# EAGLE schematic FLODAR_V3 (EAGLE 9.6.2)
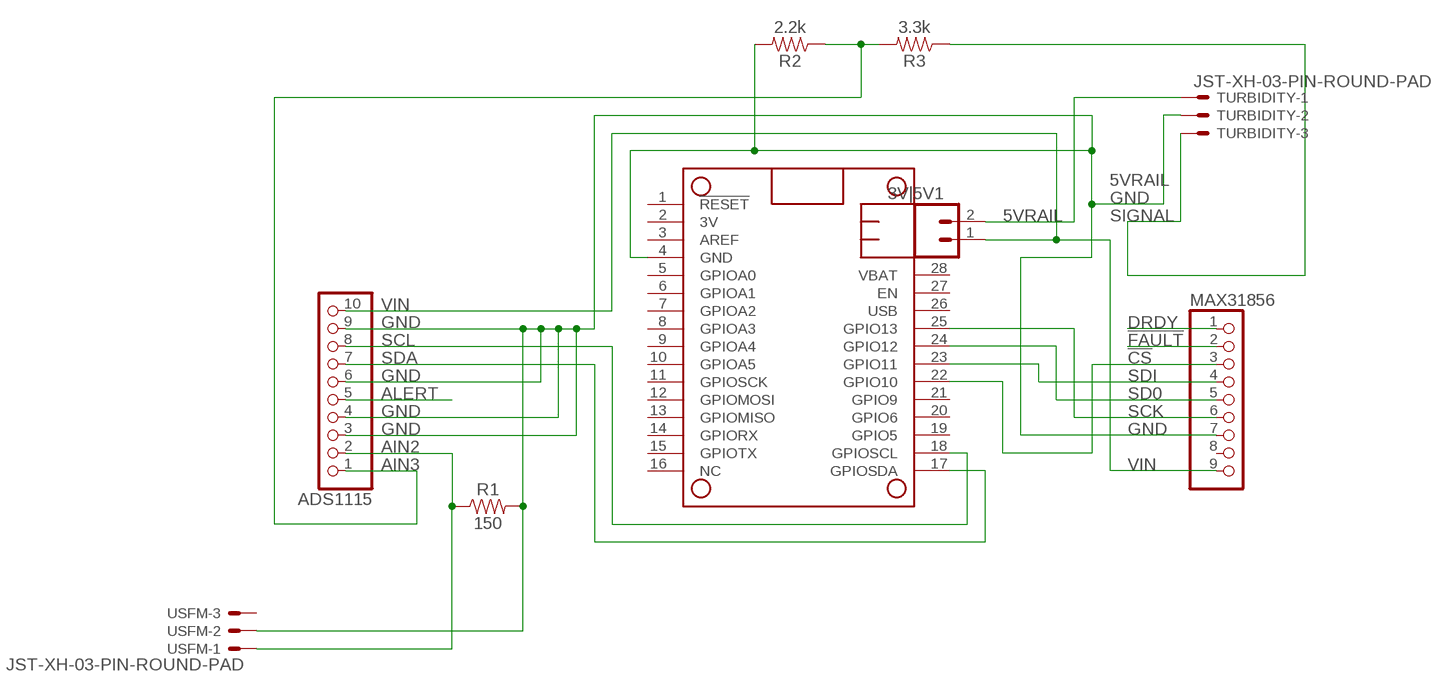
[diagram p0: schematic, sheet 1]

## Parts
3V|5V1  CONN_021X02_NO_SILK  [1X02_NO_SILK]
ADS1115  HEADER-1X1070MIL  [1X10_ROUND70]
MAX31856  HEADER-1X970MIL  [1X09_ROUND_70]
MS3  FEATHERWING  [FEATHERWING]
R1  150  150OHM-0603-1/10W-1%  [0603]
R2  2.2k  2.2KOHM-0603-1/10W-1%  [0603]
R3  3.3k  3.3KOHM-0603-1/10W-1%  [0603]
TURBIDITY  JST-XH-03-PIN-ROUND-PAD  [JST-XH-03-PACKAGE-ROUND-PAD]
USFM  JST-XH-03-PIN-ROUND-PAD  [JST-XH-03-PACKAGE-ROUND-PAD]

## Nets
5VRAIL: 3V|5V1.2 TURBIDITY.1
!CS: MAX31856.3 MS3.22(GPIO10)
!FAULT: MAX31856.2
AIN2: ADS1115.2 R1.1 USFM.1
AIN3: ADS1115.1 R2.1 R3.2
ALERT: ADS1115.5
DRDY: MAX31856.1
GND: ADS1115.3 ADS1115.4 ADS1115.6 ADS1115.9 MAX31856.7 MS3.4(GND) R1.2 R2.2 TURBIDITY.2 USFM.2
SCK: MAX31856.6 MS3.25(GPIO13)
SCL: ADS1115.8 MS3.18(GPIOSCL)
SD0: MAX31856.5 MS3.24(GPIO12)
SDA: ADS1115.7 MS3.17(GPIOSDA)
SDI: MAX31856.4 MS3.23(GPIO11)
SIGNAL: R3.1 TURBIDITY.3
VIN: 3V|5V1.1 ADS1115.10 MAX31856.9
Unconnected: MAX31856.8 MS3.1(!RESET) MS3.2(3V) MS3.3(AREF) MS3.5(GPIOA0) MS3.6(GPIOA1) MS3.7(GPIOA2) MS3.8(GPIOA3) MS3.9(GPIOA4) MS3.10(GPIOA5) MS3.11(GPIOSCK) MS3.12(GPIOMOSI) MS3.13(GPIOMISO) MS3.14(GPIORX) MS3.15(GPIOTX) MS3.16(NC) MS3.19(GPIO5) MS3.20(GPIO6) MS3.21(GPIO9) MS3.26(USB) MS3.27(EN) MS3.28(VBAT) USFM.3

## Library data of the parts
3V|5V1 = SparkFun-Connectors:CONN_02: Multi connection point. Often used as Generic Header-pin footprint for 0.1 inch spaced/style header connections On any of the 0.1 inch spaced packages, you can populate with these: Break Away Headers - Straight <https://www.sparkfun.com/products/116> (PRT-00116) Break Away Male Headers - Right Angle <https://www.sparkfun.com/products/553> (PRT-00553) Female Headers <https://www.sparkfun.com/products/115> (PRT-00115) Break Away Headers - Machine Pin <https://www.sparkfun.com/products/117> (PRT-00117) Break Away Female Headers - Swiss Machine Pin <https://www.sparkfun.com/products/743> (PRT-00743) For SCREWTERMINALS and SPRING TERMINALS visit here: Screw Terimnals on SparkFun.com <https://www.sparkfun.com/search/results?term=Screw+Terminals> (5mm/3.5mm/2.54mm spacing) This device is also useful as a general connection point to wire up your design to another part of your project. Our various solder wires solder well into these plated through hole pads. Hook-Up Wire - Assortment (Stranded, 22 AWG) <https://www.sparkfun.com/products/11375> (PRT-11375) Hook-Up Wire - Assortment (Solid Core, 22 AWG) <https://www.sparkfun.com/products/11367> (PRT-11367) View the entire wire category on our website here <https://www.sparkfun.com/categories/141> Special notes: Molex polarized connector foot print use with: PRT-08233 with associated crimp pins and housings. 2.54_SCREWTERM for use with PRT-10571. 3.5mm Screw Terminal footprints for PRT-08084 5mm Screw Terminal footprints for use with PRT-08432
ADS1115 = microbuilder:HEADER-1X10: PIN HEADER
MAX31856 = microbuilder:HEADER-1X9: PIN HEADER
MS3 = adafruit_wing:FEATHERWING
R1 = SparkFun-Resistors:150OHM: 150Ω resistor A resistor is a passive two-terminal electrical component that implements electrical resistance as a circuit element. Resistors act to reduce current flow, and, at the same time, act to lower voltage levels within circuits. - Wikipedia; PROD_ID: RES-11028
R2 = SparkFun-Resistors:2.2KOHM: 2.2kΩ resistor A resistor is a passive two-terminal electrical component that implements electrical resistance as a circuit element. Resistors act to reduce current flow, and, at the same time, act to lower voltage levels within circuits. - Wikipedia; PROD_ID: RES-08272
R3 = SparkFun-Resistors:3.3KOHM: 3.3kΩ resistor A resistor is a passive two-terminal electrical component that implements electrical resistance as a circuit element. Resistors act to reduce current flow, and, at the same time, act to lower voltage levels within circuits. - Wikipedia; PROD_ID: RES-07851
TURBIDITY USFM = Rembrandt Electronics - JST XH Connectors v1-0:JST-XH-03-PIN: JST XH Connector 2 Pin Wire to board connector. Pitch: 2,54 mm, (0.100") Number of pins: 3 Created by Rembrandt Electronics www.rembrandtelectronics.com

## Net classes
3 sig: width 0.152 mm, clearance 0.152 mm